# EAGLE design MPU-9250-mbed_rev02 (EAGLE 9.2.2)
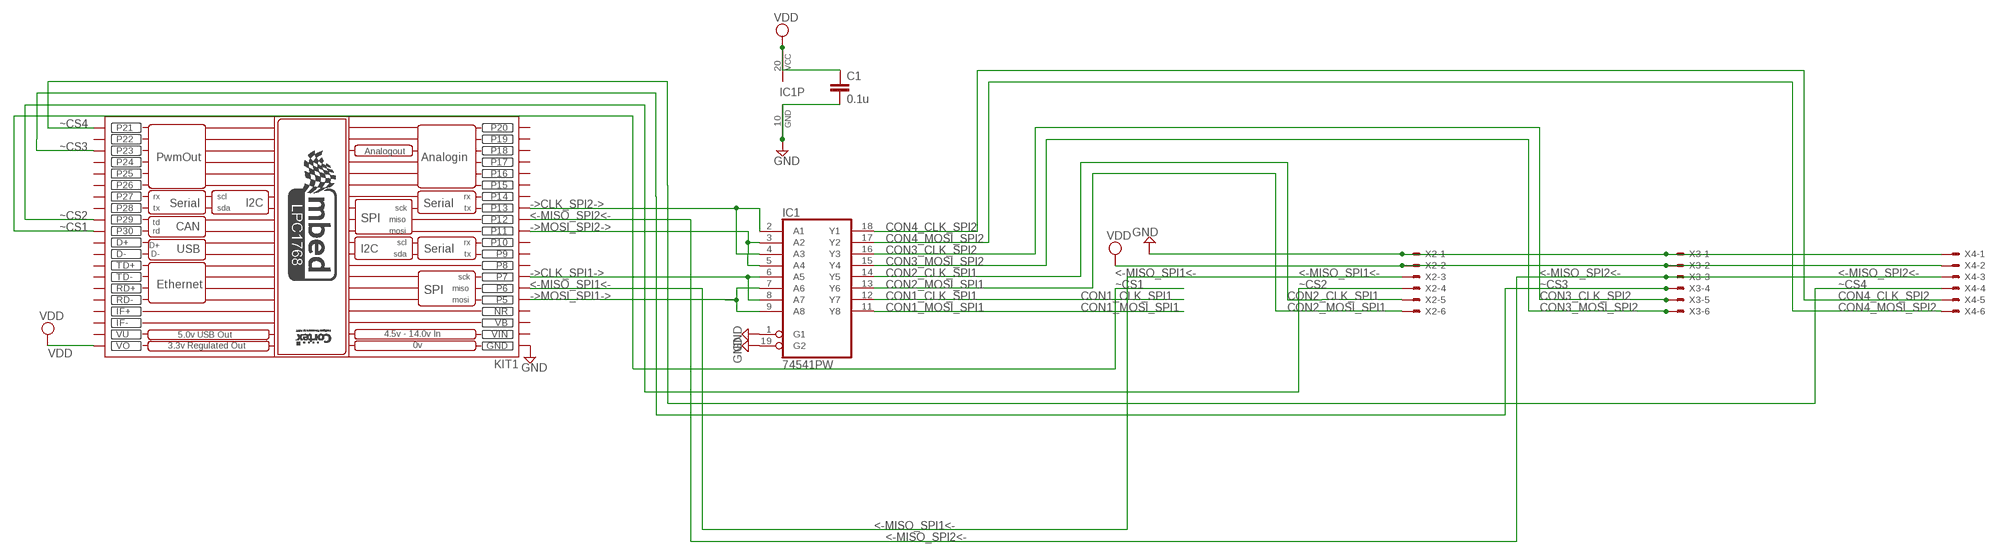
[diagram p0: schematic, sheet 1]

## Parts
C1  0.1u  C5/3  [C5B3]
IC1  74541PW  [TSSOP20]
KIT1  MBED_NXP_LPC1768  [MBED-KIT]
X2  22-23-2061  [22-23-2061]
X3  22-23-2061  [22-23-2061]
X4  22-23-2061  [22-23-2061]

## Nets
->CLK_SPI1->: IC1.6(A5) IC1.8(A7) KIT1.P$7(P7)
->CLK_SPI2->: IC1.2(A1) IC1.4(A3) KIT1.P$13(P13)
->MOSI_SPI1->: IC1.7(A6) IC1.9(A8) KIT1.P$5(P5)
->MOSI_SPI2->: IC1.3(A2) IC1.5(A4) KIT1.P$11(P11)
<-MISO_SPI1<-: KIT1.P$6(P6) X2.3
<-MISO_SPI2<-: KIT1.P$12(P12) X3.3 X4.3
CON1_CLK_SPI1: IC1.12(Y7)
CON1_MOSI_SPI1: IC1.11(Y8)
CON2_CLK_SPI1: IC1.14(Y5) X2.5
CON2_MOSI_SPI1: IC1.13(Y6) X2.6
CON3_CLK_SPI2: IC1.16(Y3) X3.5
CON3_MOSI_SPI2: IC1.15(Y4) X3.6
CON4_CLK_SPI2: IC1.18(Y1) X4.5
CON4_MOSI_SPI2: IC1.17(Y2) X4.6
GND: C1.2 IC1.1(G1) IC1.10(GND) IC1.19(G2) KIT1.GND X2.1 X3.1 X4.1
VDD: C1.1 IC1.20(VCC) KIT1.VOUT(VO) X2.2 X3.2 X4.2
~CS1: KIT1.P$30(P30)
~CS2: KIT1.P$29(P29) X2.4
~CS3: KIT1.P$23(P23) X3.4
~CS4: KIT1.P$21(P21) X4.4
Unconnected: KIT1.D+ KIT1.D- KIT1.IF+ KIT1.IF- KIT1.P$8(P8) KIT1.P$9(P9) KIT1.P$10(P10) KIT1.P$14(P14) KIT1.P$15(P15) KIT1.P$16(P16) KIT1.P$17(P17) KIT1.P$18(P18) KIT1.P$19(P19) KIT1.P$20(P20) KIT1.P$22(P22) KIT1.P$24(P24) KIT1.P$25(P25) KIT1.P$26(P26) KIT1.P$27(P27) KIT1.P$28(P28) KIT1.RD+ KIT1.RD- KIT1.TD+ KIT1.TD-

## Power pins joined to a net without a drawn wire
NR: KIT1.NR
VB: KIT1.VB
VIN: KIT1.VIN
VU: KIT1.VU

## Library data of the parts
C1 = capacitor-wima:C: CAPACITOR naming: grid - package width
IC1 = 74xx-us:74*541: Octal BUFFER and LINE DRIVER, 3-state
KIT1 = MBED_v2.1:MBED_NXP_LPC1768: Mbed LPC1768 - ARM CORTEX v2.1 * Schematic symbol is now placed in eagles's default raster. *The pads diameter are suitable for routing between mbed pins * mbed pads are 0.8 mm drill diameter. --------------------------------------------- Created by: Mohamed Yousry *Alexandria, Egypt *Email: mohamed.yousry@ieeegoldegypt.org
X2-X4 = con-molex:22-23-2061: .100" (2.54mm) Center Header - 6 Pin; MF: MOLEX; MPN: 22-23-2061; OC_FARNELL: 1462922; OC_NEWARK: 27C1933

## Board
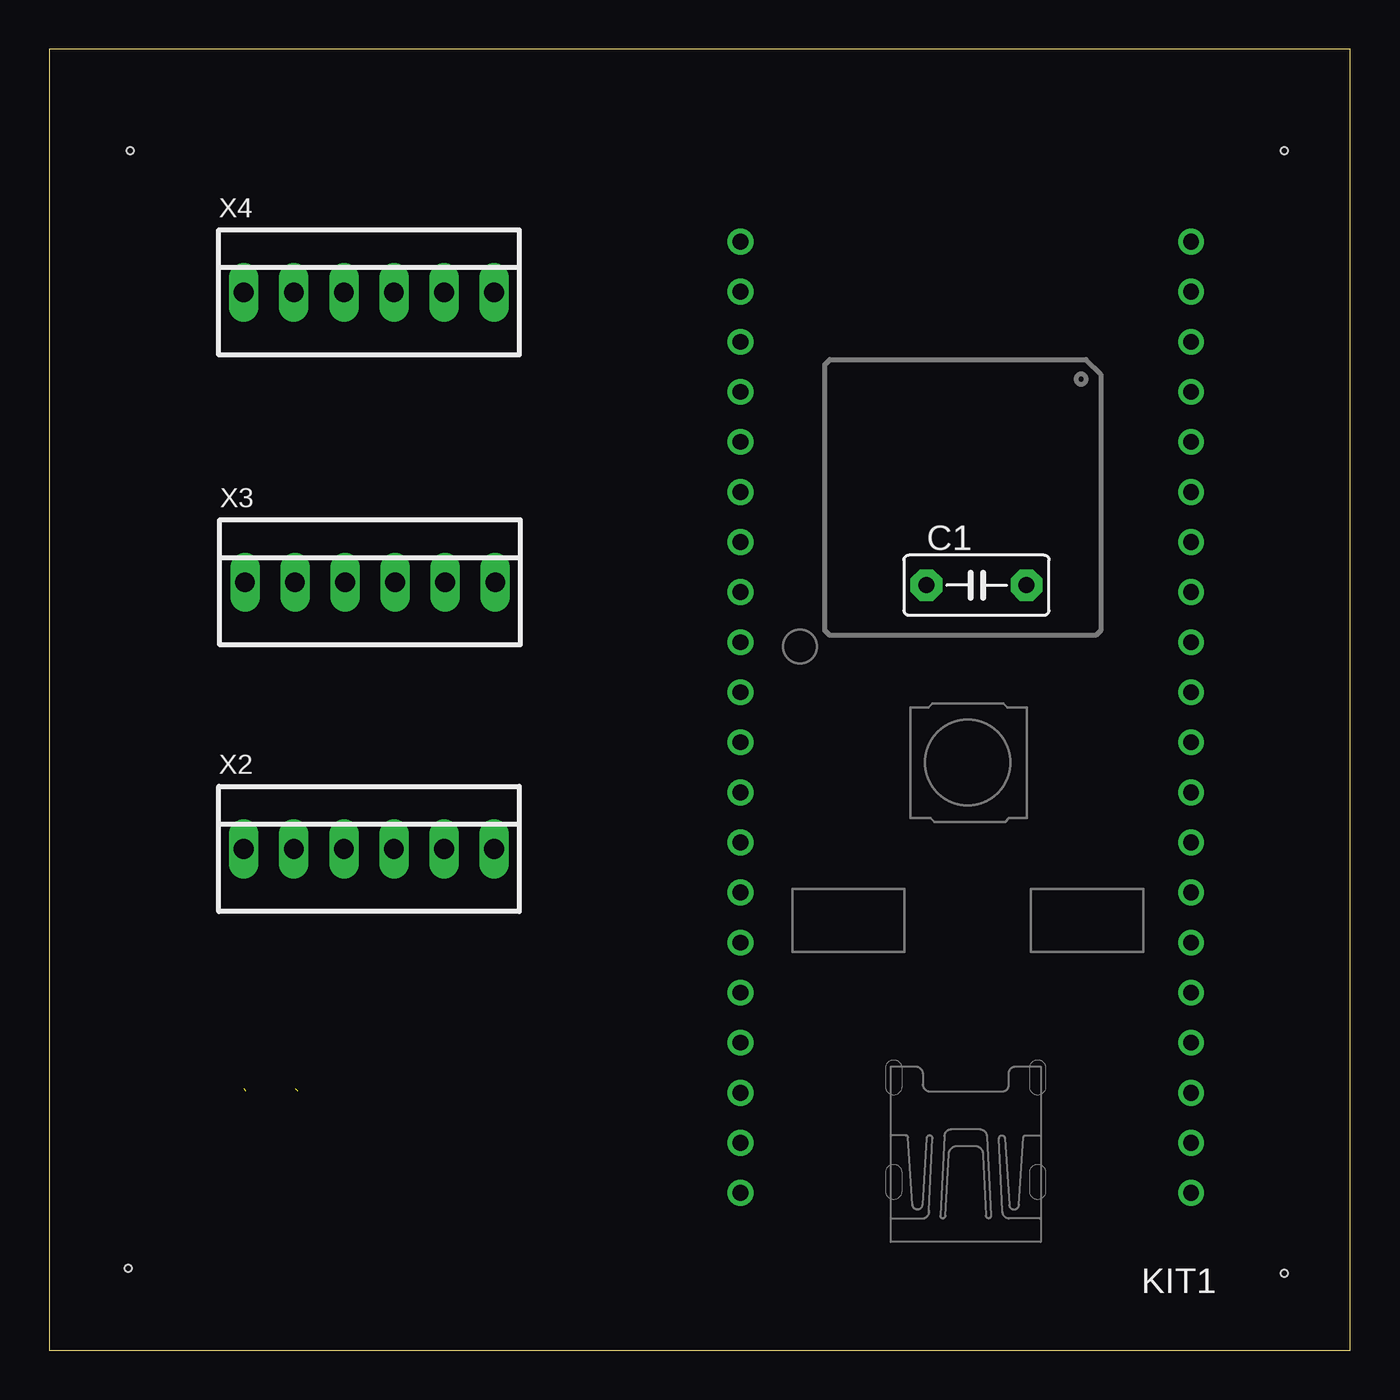
[diagram p1: board, top side]
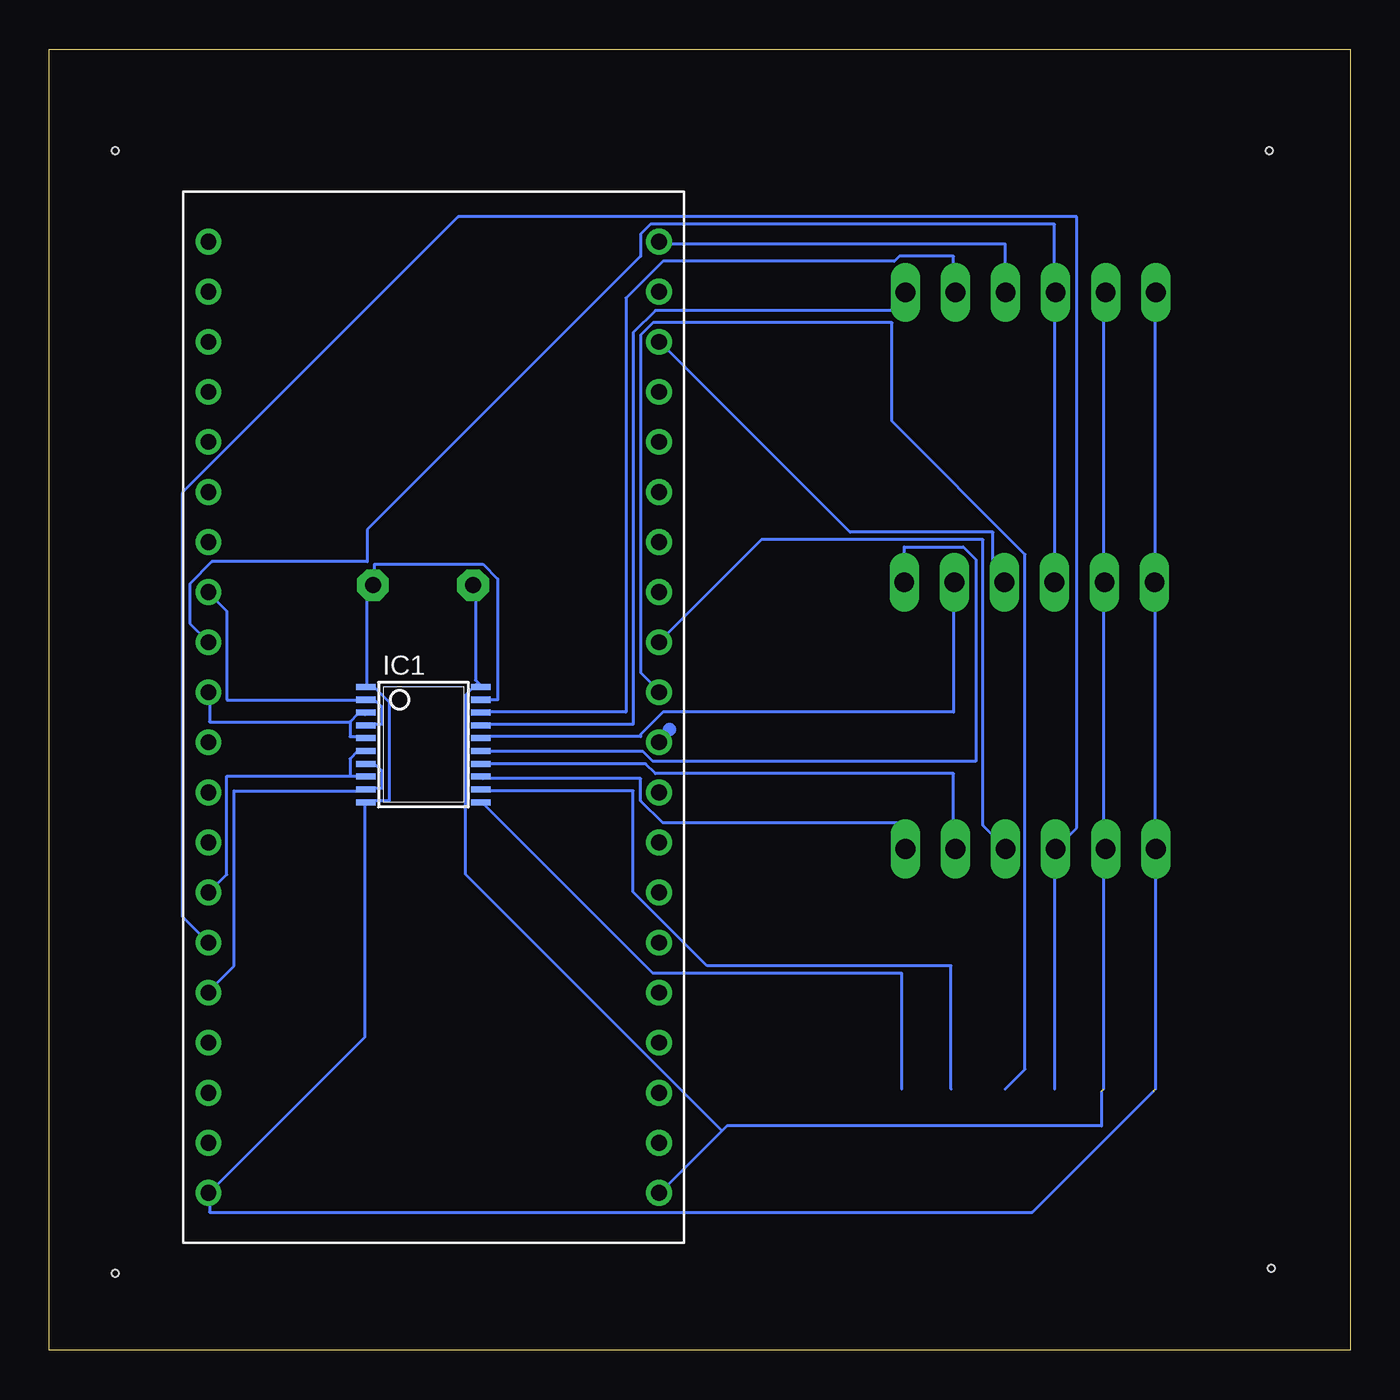
[diagram p2: board, bottom side, seen from below]

Size 66 x 66 mm. Coordinates in mm from the lower left corner, seen from the top.
Outline: 0,0 66,0 66,66 0,66 0,0
Copper layers (1*16): Top 0.035mm / dielectric 1.5mm / Bottom 0.035mm
Design rules "default": minimum track width 6mil, minimum drill 0.35mm, track to track 6mil, track to pad 6mil, pad to pad 6mil, via to via 6mil, smd to smd 6mil, copper to edge 40mil, drill to drill 6mil, minimum pad ring 10mil, minimum via ring 8mil, stop-mask expansion 4mil, vias tented up to drill 0mil, thermal gap 10mil
Holes 0.35 mm at 4,4.15 4.11,60.86 62.66,60.85 62.66,3.91

### Footprints (pad centres in the part's own frame; a part is rotated, then mirrored left to right if it is on the bottom)
C5B3 = drill 0.813 pad 1.6 octagon: 1 -2.54,0; 2 2.54,0
TSSOP20 = smd 0.305 x 0.991: 1 -2.925,-2.918; 2 -2.275,-2.918; 3 -1.625,-2.918; 4 -0.975,-2.918; 5 -0.325,-2.918; 6 0.325,-2.918; 7 0.975,-2.918; 8 1.625,-2.918; 9 2.275,-2.918; 10 2.925,-2.918; 11 2.925,2.918; 12 2.275,2.918; 13 1.625,2.918; 14 0.975,2.918; 15 0.325,2.918; 16 -0.325,2.918; 17 -0.975,2.918; 18 -1.625,2.918; 19 -2.275,2.918; 20 -2.925,2.918
MBED-KIT = drill 0.8: D+ 11.43,1.27; D- 11.43,3.81; GND -11.43,24.13; IF+ 11.43,16.51; IF- 11.43,19.05; NR -11.43,16.51; P$5 -11.43,13.97; P$6 -11.43,11.43; P$7 -11.43,8.89; P$8 -11.43,6.35; P$9 -11.43,3.81; P$10 -11.43,1.27; P$11 -11.43,-1.27; P$12 -11.43,-3.81; P$13 -11.43,-6.35; P$14 -11.43,-8.89; P$15 -11.43,-11.43; P$16 -11.43,-13.97; P$17 -11.43,-16.51; P$18 -11.43,-19.05; P$19 -11.43,-21.59; P$20 -11.43,-24.13; P$21 11.43,-24.13; P$22 11.43,-21.59; P$23 11.43,-19.05; P$24 11.43,-16.51; P$25 11.43,-13.97; P$26 11.43,-11.43; P$27 11.43,-8.89; P$28 11.43,-6.35; P$29 11.43,-3.81; P$30 11.43,-1.27; RD+ 11.43,11.43; RD- 11.43,13.97; TD+ 11.43,6.35; TD- 11.43,8.89; VB -11.43,19.05; VIN -11.43,21.59; VOUT 11.43,24.13; VU 11.43,21.59
22-23-2061 = drill 1 long: 1 -6.35,0; 2 -3.81,0; 3 -1.27,0; 4 1.27,0; 5 3.81,0; 6 6.35,0

### Placement (x,y rotation side)
C1  47.04,38.82 0 top
IC1  47.01,30.73 270 bottom
KIT1  46.49,32.11 180 top
X2  16.22,25.43 0 top
X3  16.28,38.96 0 top
X4  16.22,53.66 0 top

### Tracks (layer width: path | path; a pad name or v marks a point on that pad's centre or on a via)
->CLK_SPI1->
  Bottom 0.152: 50.75,29.12 50,29.12 IC1.8 | 50.75,29.12 50.75,30 50.38,30.38 50,30.38 IC1.6 | 50.75,29.12 57,29.12 57,24.12 57.88,23.25 KIT1.P$7
->CLK_SPI2->
  Bottom 0.152: IC1.4 49.88,31.75 49.12,31.75 49.12,32.62 49.5,33 IC1.2 57,33 57,37.5 57.88,38.38 KIT1.P$13
->MOSI_SPI1->
  Bottom 0.152: IC1.7 49.5,29.75 49.12,29.38 49.12,28.5 49.88,28.5 IC1.9 50,28.38 56.62,28.38 56.62,19.5 57.88,18.25 KIT1.P$5
->MOSI_SPI2->
  Bottom 0.152: 50.75,31.88 50.75,31.12 50,31.12 IC1.5 | 50.75,31.88 50.38,32.25 50,32.25 IC1.3 | 50.75,31.88 57.88,31.88 57.88,33.38 KIT1.P$11
<-MISO_SPI1<-
  Bottom 0.152: KIT1.P$6 58,20.75 59.25,22 59.25,43.5 45.25,57.5 13.88,57.5 13.88,26.5 14.88,25.5 X2.3 15,25.38 15,13.25
<-MISO_SPI2<-
  Bottom 0.152: KIT1.P$12 58,36 58.88,36.88 58.88,38.88 57.75,40 49.88,40 49.88,41.62 36,55.5 36,56.62 35.5,57.12 15,57.12 15,53.75 X4.3 15,53.62 15,39 X3.3
CON1_CLK_SPI1
  Bottom 0.152: 20.25,13.25 20.25,19.5 32.62,19.5 36.38,23.25 36.38,28.38 44,28.38 IC1.12
CON1_MOSI_SPI1
  Bottom 0.152: 22.75,13.25 22.75,19.12 35.38,19.12 44,27.75 IC1.11
CON2_CLK_SPI1
  Bottom 0.152: IC1.14 35.75,29.75 35.25,29.25 20.12,29.25 20.12,25.5 X2.5
CON2_MOSI_SPI1
  Bottom 0.152: IC1.13 44,29 36,29 36,27.88 34.88,26.75 22.62,26.75 22.62,25.5 X2.6
CON3_CLK_SPI2
  Bottom 0.152: IC1.16 44,31.12 36,31.12 36,31.25 34.88,32.38 20.12,32.38 20.12,38.88 X3.5
CON3_MOSI_SPI2
  Bottom 0.152: IC1.15 44,30.38 35.88,30.38 35.38,29.88 19,29.88 19,40.12 19.62,40.75 22.62,40.75 22.62,39 X3.6
CON4_CLK_SPI2
  Bottom 0.152: IC1.18 44,32.38 36.75,32.38 36.75,53.38 34.88,55.25 23.12,55.25 22.88,55.5 20.12,55.5 20.12,53.75 X4.5
CON4_MOSI_SPI2
  Bottom 0.152: IC1.17 44,31.75 36.38,31.75 36.38,51.62 35.25,52.75 22.62,52.75 22.62,53.62 X4.6
GND  (1 unrouted)
  Bottom 0.152: 9.88,13.25 9.88,25.38 X2.1 9.88,25.5 9.88,38.88 X3.1 9.88,39 9.88,53.62 X4.1 | IC1.19 43.25,33 43.25,39.12 44,39.88 49.5,39.88 49.5,38.88 C1.2 49.62,38.75 49.88,38.5 49.88,33.75 IC1.1 49.88,33.62 49.5,33.62 48.75,32.88 48.75,27.88 49.88,27.88 IC1.10 50,27.75 50,15.88 57.88,8 KIT1.GND 57.88,7.88 57.88,7 16.12,7 10,13.12
VDD  (1 unrouted)
  Bottom 0.152: 44.25,33.88 44.38,34 44.38,38.75 C1.1 | 44.25,33.88 44.12,33.75 IC1.20 | 31.88,11.12 31.62,11.38 12.62,11.38 12.62,13.12 | 31.88,11.12 35,8 KIT1.VOUT | 12.5,13.25 12.5,25.38 X2.2 12.5,25.5 12.5,38.88 X3.2 12.5,39 12.5,53.62 X4.2 | 44.25,33.88 44.88,33.25 44.88,24.12 31.88,11.12
~CS1
  Bottom 0.152: 17.5,13.25 16.5,14.25 16.5,40.38 23.25,47.12 23.25,52.12 35.38,52.12 36,51.5 36,34.38 35.12,33.5 KIT1.P$30
~CS2
  Bottom 0.152: KIT1.P$29 35,36 29.88,41.12 18.62,41.12 18.62,26.62 17.5,25.5 X2.4
~CS3
  Bottom 0.152: KIT1.P$23 35,51.12 25.38,41.5 18.12,41.5 18.12,39.5 17.62,39 X3.4
~CS4
  Bottom 0.152: KIT1.P$21 35,56.12 17.5,56.12 17.5,53.75 X4.4
(copper drawn outside any net)
  shapes: Bottom circle x1